# EAGLE design ServoV2 (EAGLE 7.1.0)
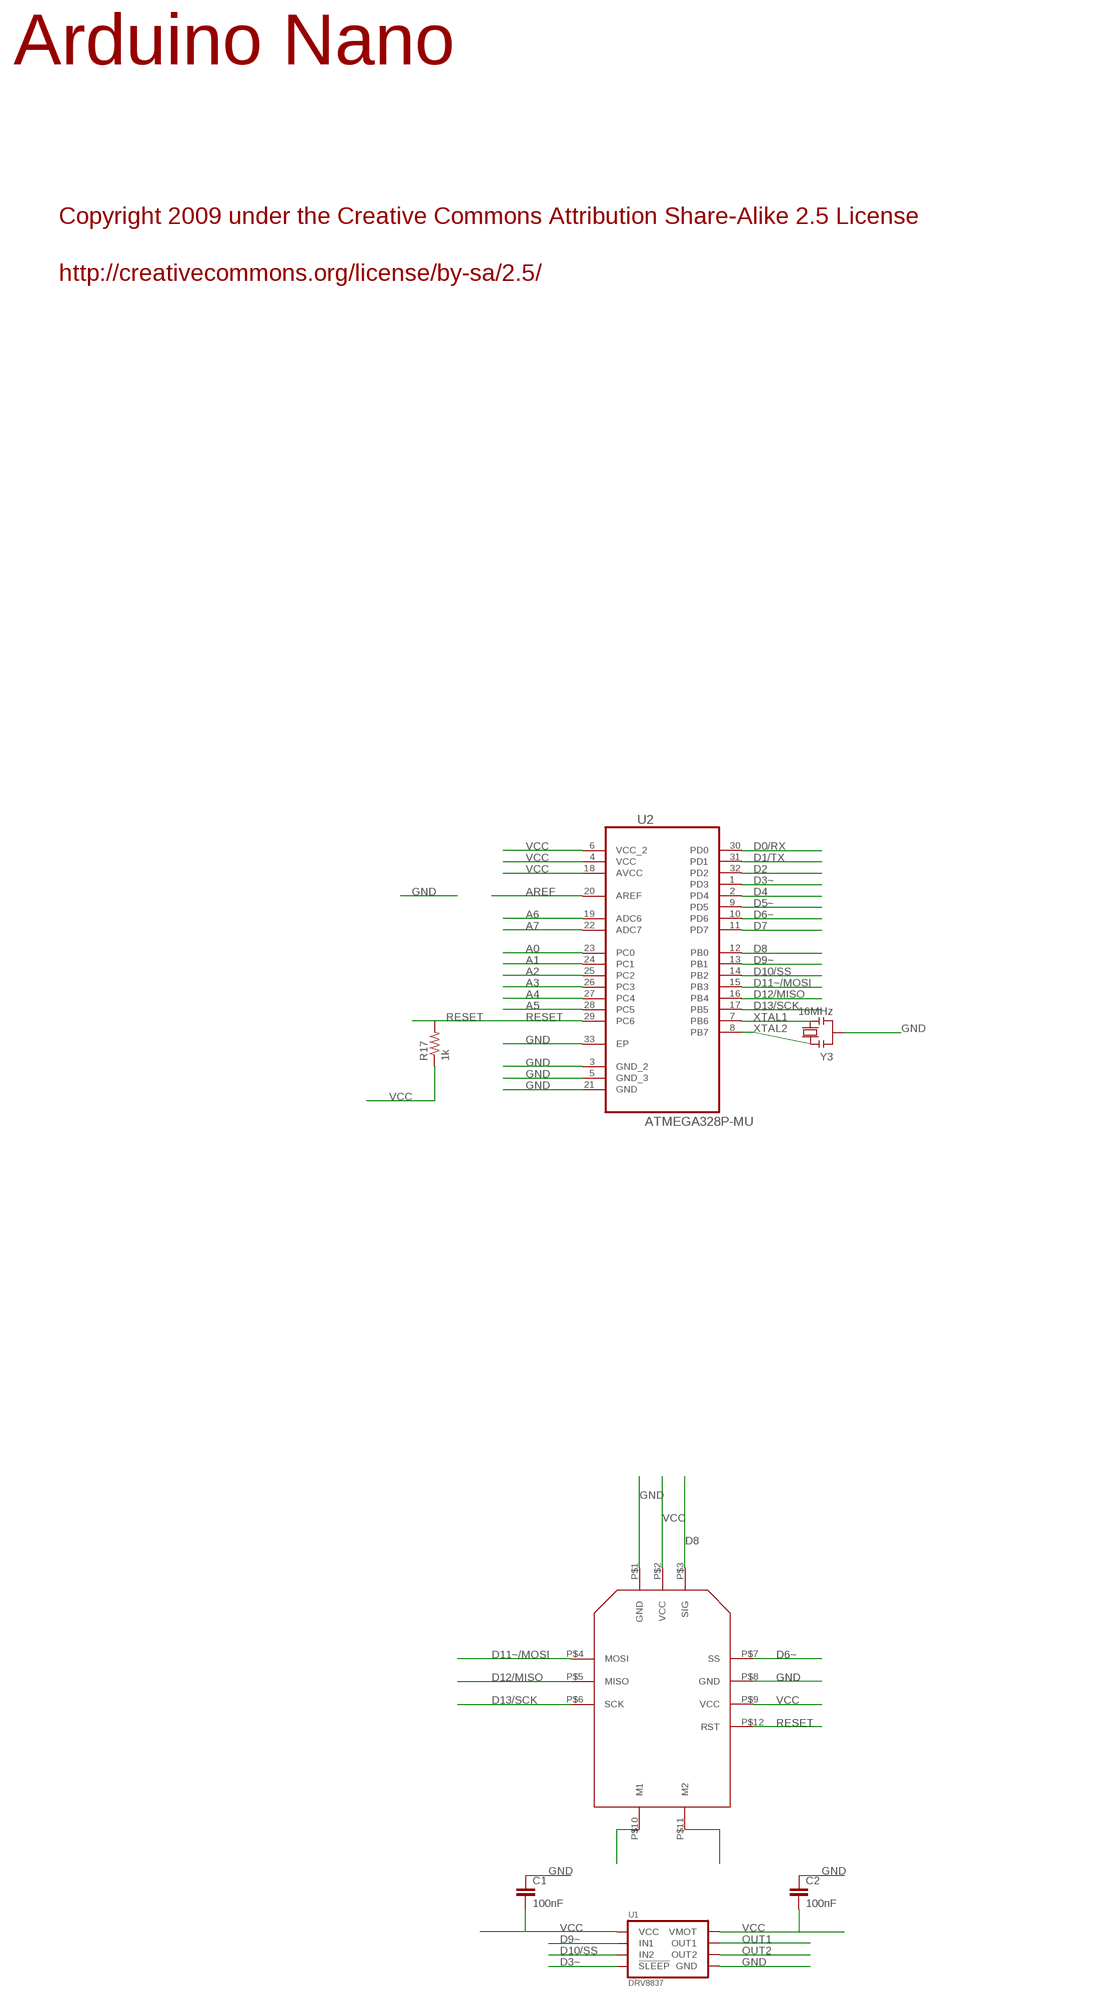
[diagram p0: schematic, sheet 1, part 1 of 2]
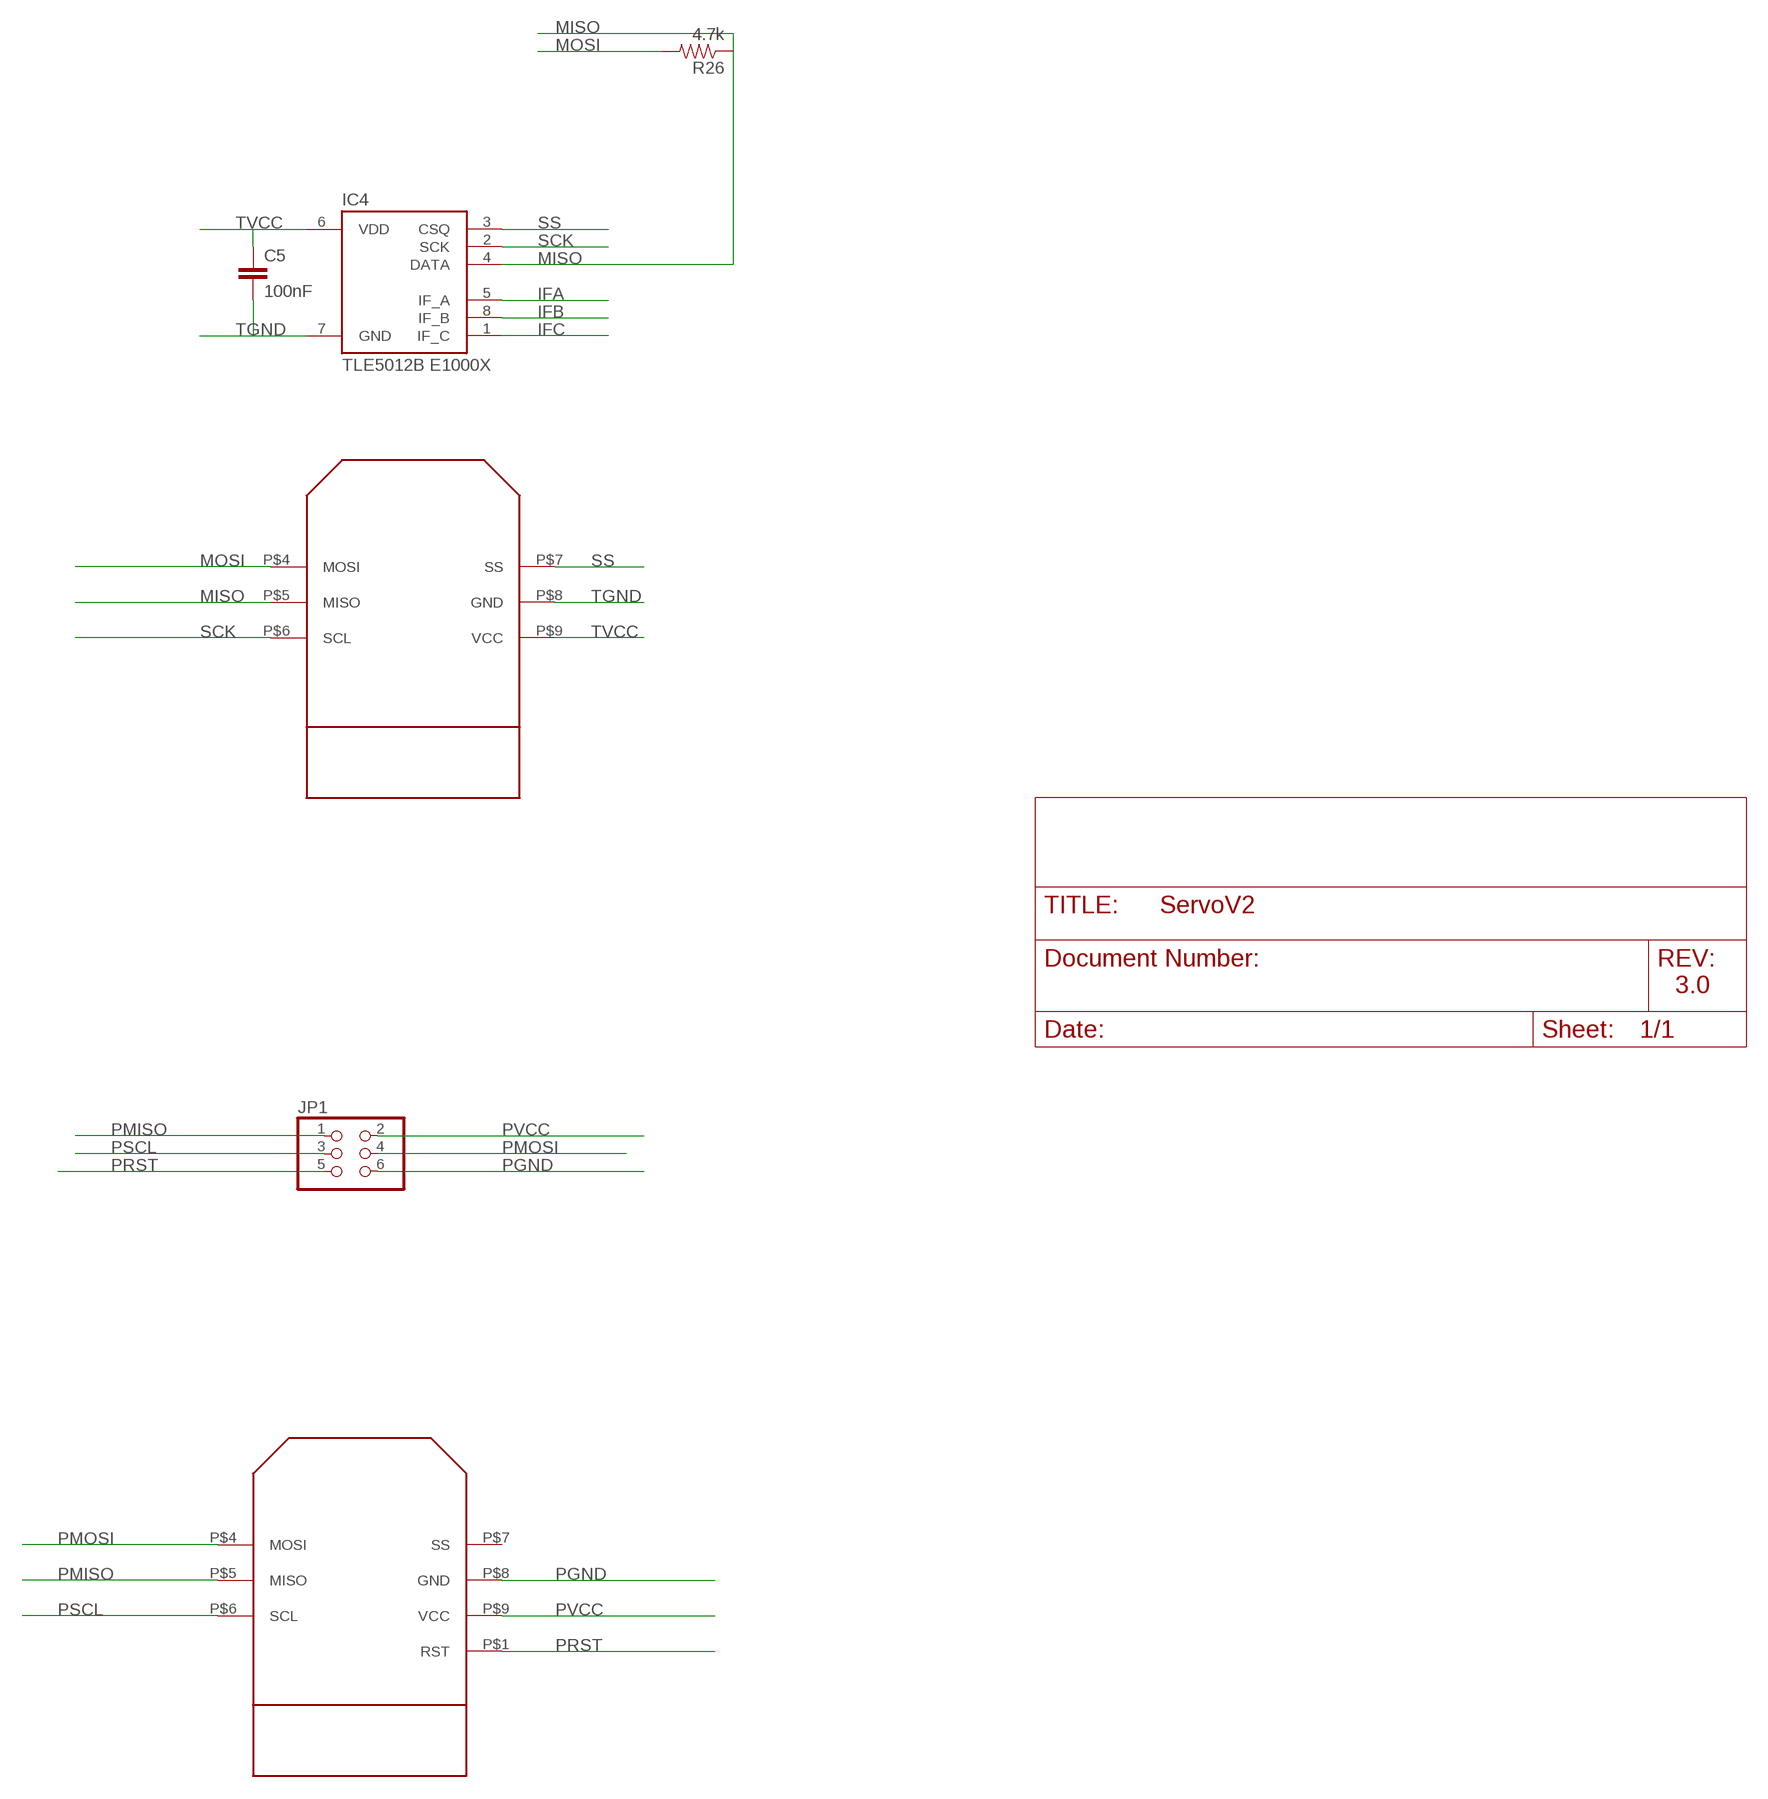
[diagram p1: schematic, sheet 1, part 2 of 2]

## Parts
C1  100nF  0.33UF-50V-10%(0805)  [0805-CAP]
C2  100nF  0.33UF-50V-10%(0805)  [0805-CAP]
C5  100nF  0.33UF-50V-10%(0805)  [0805-CAP]
IC4  TLE5012B E1000X  TLE5012B  [SO08]
JP1  PINHD-2X3  [2X03]
R17  1k  0.05OHM-1/5W-1%(0603)  [0603]
R26  4.7k  0.05OHM-1/5W-1%(0603)  [0603]
U1  DRV8837  [DSG]
U2  ATMEGA328P-MU  [QFN50P500X500X100-33N]
U$1  2TOPSIG  [2TOPSIG]
U$2  2BOTSIG  [2BOTTOMSIG]
U$3  PRGRMR  [PRGRMR]
Y3  16MHz  RESONATORMU  [RESONATOR]

## Nets
A0: U2.23(PC0)
A1: U2.24(PC1)
A2: U2.25(PC2)
A3: U2.26(PC3)
A4: U2.27(PC4)
A5: U2.28(PC5)
A6: U2.19(ADC6)
A7: U2.22(ADC7)
AREF: U2.20(AREF)
D0/RX: U2.30(PD0)
D1/TX: U2.31(PD1)
D2: U2.32(PD2)
D3~: U1.7(!SLEEP) U2.1(PD3)
D4: U2.2(PD4)
D5~: U2.9(PD5)
D6~: U2.10(PD6) U$2.P$7(SS)
D7: U2.11(PD7)
D8: U2.12(PB0) U$2.P$3(SIG)
D9~: U1.6(IN1) U2.13(PB1)
D10/SS: U1.5(IN2) U2.14(PB2)
D11~/MOSI: U2.15(PB3) U$2.P$4(MOSI)
D12/MISO: U2.16(PB4) U$2.P$5(MISO)
D13/SCK: U2.17(PB5) U$2.P$6(SCK)
GND: C1.1 C2.1 U1.4(GND) U1.PAD(GND) U2.3(GND_2) U2.5(GND_3) U2.21(GND) U2.33(EP) U$2.P$1(GND) U$2.P$8(GND) Y3.2
IFA: IC4.5(IF_A)
IFB: IC4.8(IF_B)
IFC: IC4.1(IF_C)
MISO: IC4.4(DATA) R26.1 U$1.P$5(MISO)
MOSI: R26.2 U$1.P$4(MOSI)
OUT1: U1.2(OUT1) U$2.P$11(M2)
OUT2: U1.3(OUT2) U$2.P$10(M1)
PGND: JP1.6 U$3.P$8(GND)
PMISO: JP1.1 U$3.P$5(MISO)
PMOSI: JP1.4 U$3.P$4(MOSI)
PRST: JP1.5 U$3.P$1(RST)
PSCL: JP1.3 U$3.P$6(SCL)
PVCC: JP1.2 U$3.P$9(VCC)
RESET: R17.2 U2.29(PC6) U$2.P$12(RST)
SCK: IC4.2(SCK) U$1.P$6(SCL)
SS: IC4.3(CSQ) U$1.P$7(SS)
TGND: C5.2 IC4.7(GND) U$1.P$8(GND)
TVCC: C5.1 IC4.6(VDD) U$1.P$9(VCC)
VCC: C1.2 C2.2 R17.1 U1.1(VMOT) U1.8(VCC) U2.4(VCC) U2.6(VCC_2) U2.18(AVCC) U$2.P$2(VCC) U$2.P$9(VCC)
XTAL1: U2.7(PB6) Y3.3
XTAL2: U2.8(PB7) Y3.1
Unconnected: U$3.P$7(SS)

## Notes on the sheet
- Arduino Nano
- Copyright 2009 under the Creative Commons Attribution Share-Alike 2.5 License
- http://creativecommons.org/license/by-sa/2.5/
- 3.0

## Library data of the parts
C1 C2 C5 = SparkFun-Capacitors:0.33UF-50V-10%(0805): CAP-08469; PROD_ID: CAP-08469; VALUE: 0.33uF
IC4 = # stdlib:TLE5012B
JP1 = 2x3pinhd:PINHD-2X3: PIN HEADER
R17 R26 = SparkFun-Resistors:0.05OHM-1/5W-1%(0603); PROD_ID: RES-12535
U1 = packages(ti):DRV8837
U2 = Atmel_By_element14_Batch_1-00:ATMEGA328P-MU: Programmable Flash; MPN: ATMEGA328P-MU; OC_FARNELL: 1748522; OC_NEWARK: 26R2526; PACKAGE: QFN-32; SUPPLIER: Atmel
U$1 = Servo:2TOPSIG
U$2 = Servo:2BOTSIG
U$3 = Servo:PRGRMR
Y3 = resonator:RESONATOR

## Board
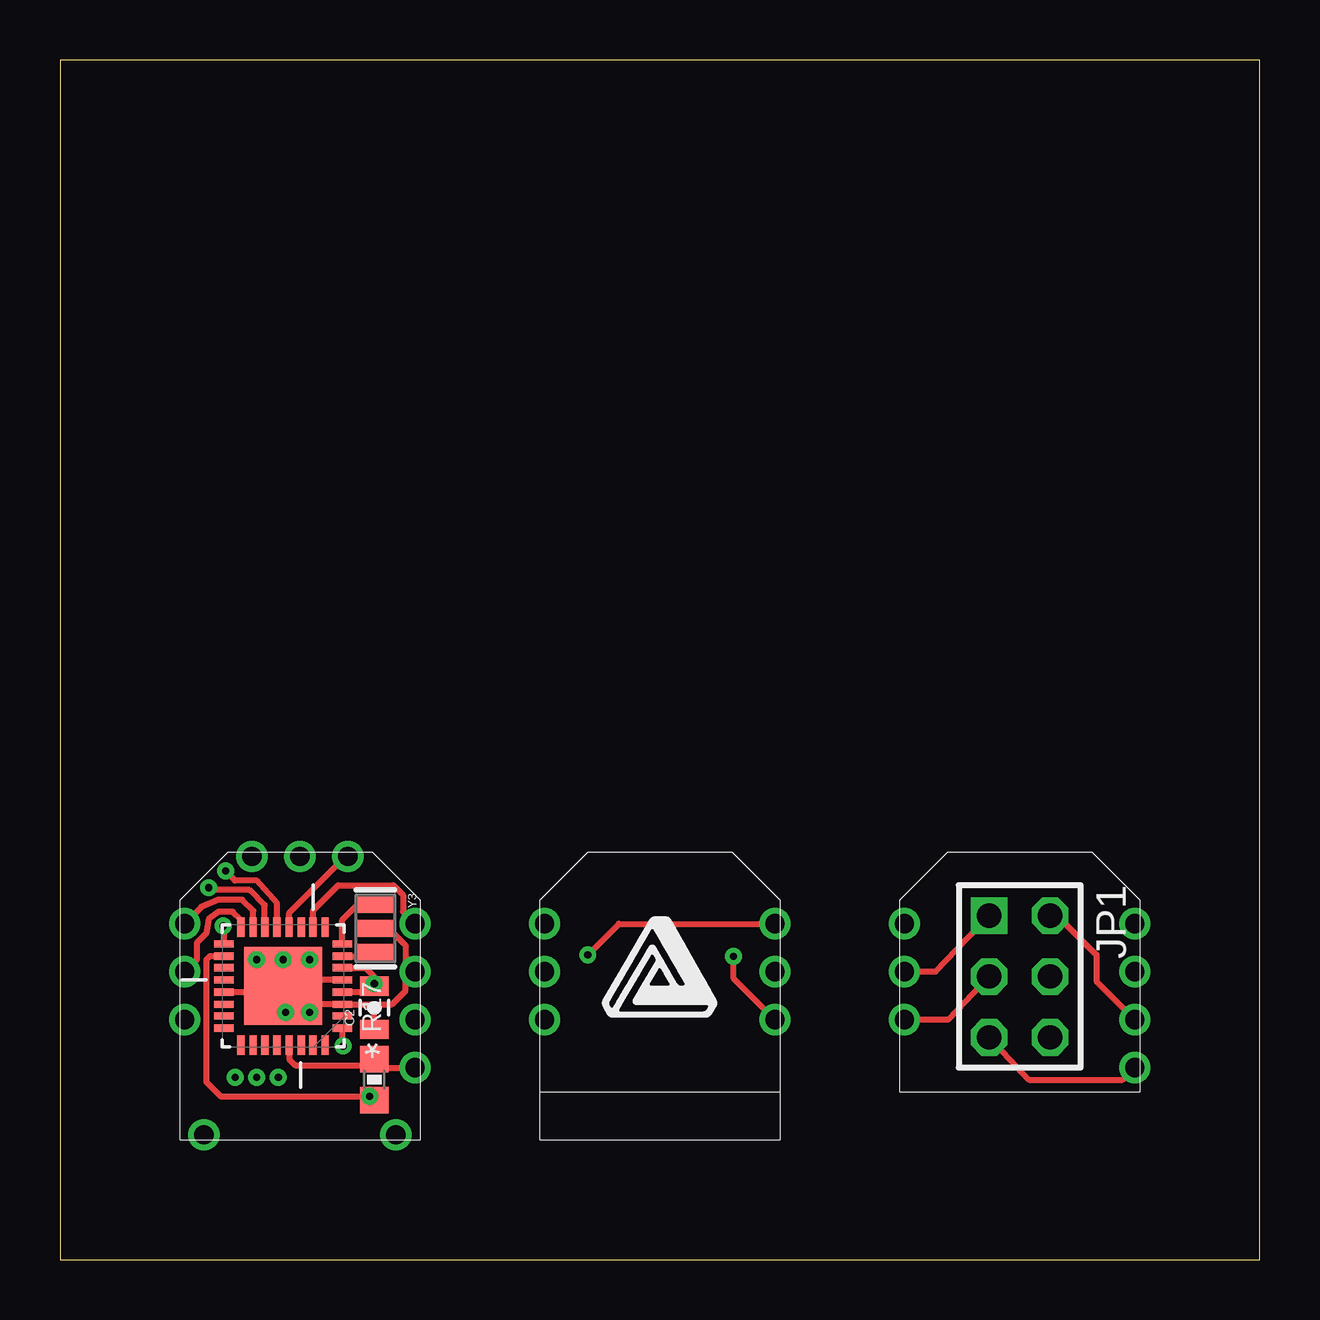
[diagram p2: board, top side]
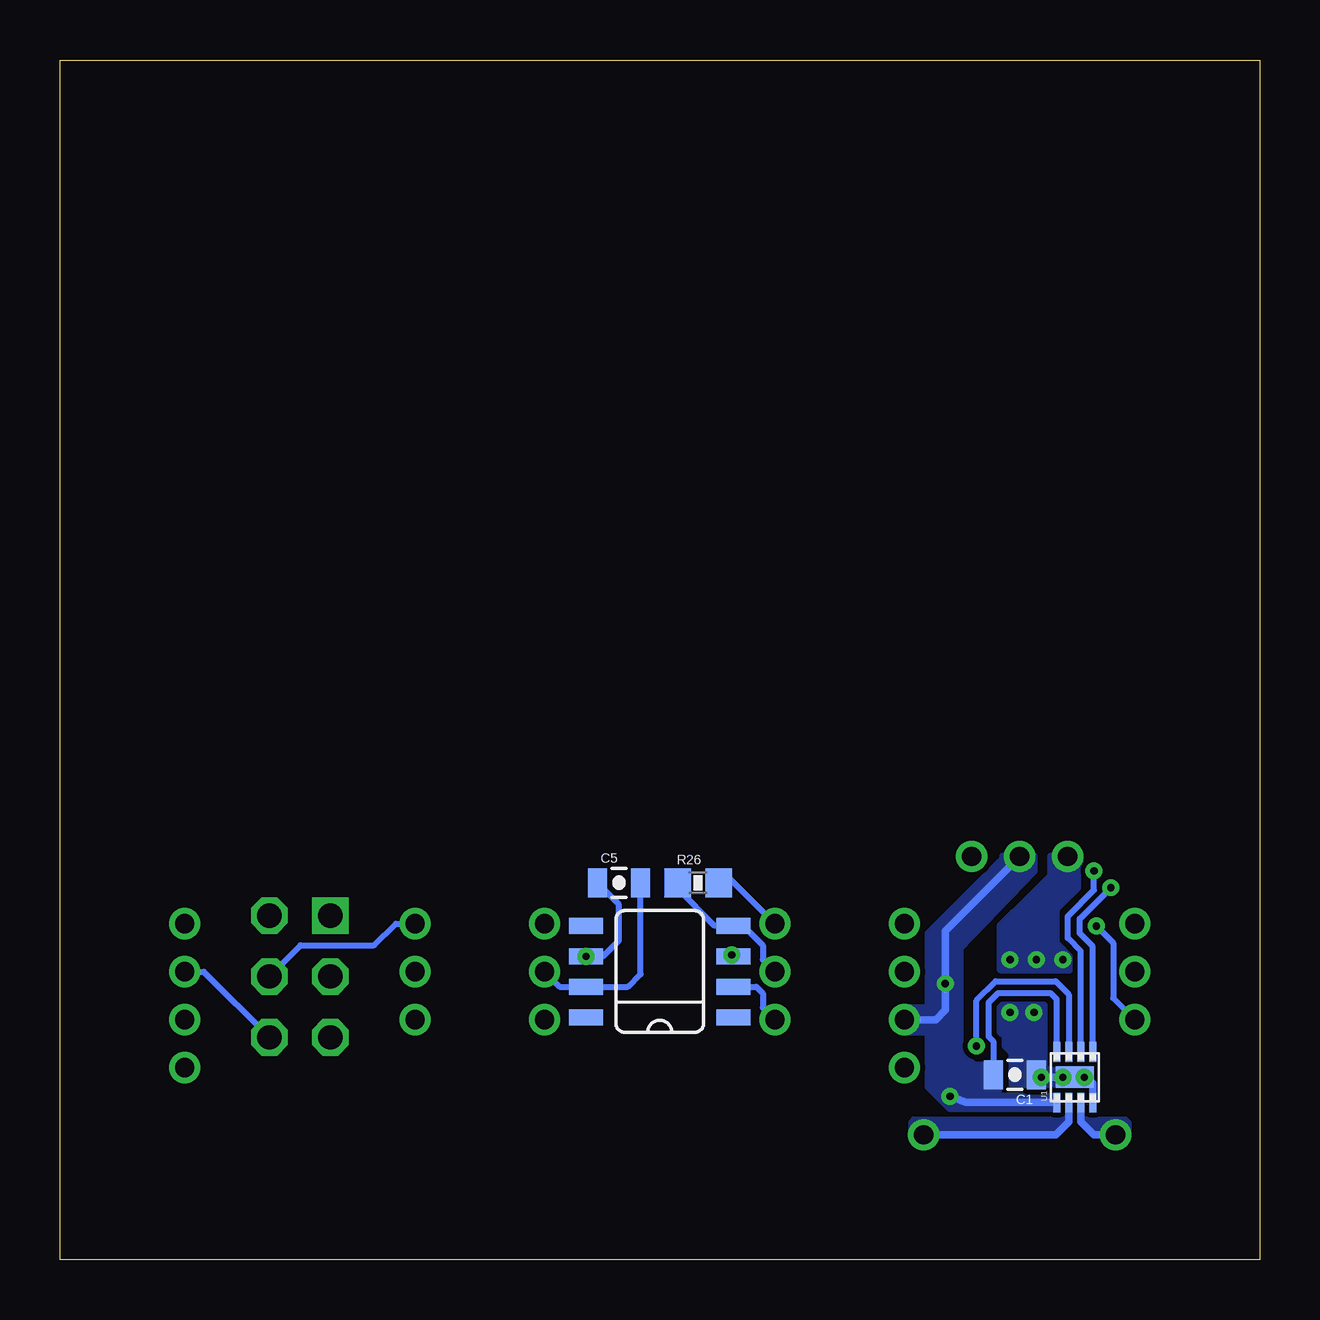
[diagram p3: board, bottom side, seen from below]

Size 50 x 50 mm. Coordinates in mm from the lower left corner, seen from the top.
Outline: 0,0 50,0 50,50 0,50 0,0
Copper layers (1*16): Top 0.035mm / dielectric 1.2mm / Bottom 0.035mm
Design rules "defaultjelle": minimum track width 10mil, minimum drill 13mil, track to track 8mil, track to pad 8mil, pad to pad 8mil, via to via 8mil, smd to smd 8mil, copper to edge 0.3mm, drill to drill 0.25mm, minimum pad ring 10mil, minimum via ring 8mil, stop-mask expansion 4mil, vias tented up to drill 0mil, thermal gap 10mil

### Footprints (pad centres in the part's own frame; a part is rotated, then mirrored left to right if it is on the bottom)
0805-CAP = smd 0.8 x 1.2: 1 -0.9,0; 2 0.9,0
SO08 = smd 0.66 x 1.397: 1 0,-3.073; 2 1.27,-3.073; 3 2.54,-3.073; 4 3.81,-3.073; 5 3.81,3.073; 6 2.54,3.073; 7 1.27,3.073; 8 0,3.073
2X03 = drill 1.016 square: 1 -2.54,-1.27 | drill 1.016 octagon: 2 -2.54,1.27; 3 0,-1.27; 4 0,1.27; 5 2.54,-1.27; 6 2.54,1.27
0603 = smd 1.1 x 1.2: 1 -0.85,0; 2 0.85,0
DSG = smd 0.813 x 0.305: 1 -1.056,0.75; 2 -1.056,0.25; 3 -1.056,-0.25; 4 -1.056,-0.75; 5 1.056,-0.75; 6 1.056,-0.25; 7 1.056,0.25; 8 1.056,0.75 | smd 0.9 x 1.6: PAD 0,0
QFN50P500X500X100-33N = smd 0.813 x 0.305: 1 -2.464,1.753; 2 -2.464,1.245; 3 -2.464,0.762; 4 -2.464,0.254; 5 -2.464,-0.254; 6 -2.464,-0.762; 7 -2.464,-1.245; 8 -2.464,-1.753; 17 2.464,-1.753; 18 2.464,-1.245; 19 2.464,-0.762; 20 2.464,-0.254; 21 2.464,0.254; 22 2.464,0.762; 23 2.464,1.245; 24 2.464,1.753 | smd 0.305 x 0.813: 9 -1.753,-2.464; 10 -1.245,-2.464; 11 -0.762,-2.464; 12 -0.254,-2.464; 13 0.254,-2.464; 14 0.762,-2.464; 15 1.245,-2.464; 16 1.753,-2.464; 25 1.753,2.464; 26 1.245,2.464; 27 0.762,2.464; 28 0.254,2.464; 29 -0.254,2.464; 30 -0.762,2.464; 31 -1.245,2.464; 32 -1.753,2.464 | smd 3.251 x 3.251: 33 0,0
2TOPSIG = drill 0.8: P$4 0.2,9; P$5 0.2,7; P$6 0.2,5; P$7 9.8,9; P$8 9.8,7; P$9 9.8,5
2BOTTOMSIG = drill 0.8: P$1 3,11.8; P$2 5,11.8; P$3 7,11.8; P$4 0.2,9; P$5 0.2,7; P$6 0.2,5; P$7 9.8,9; P$8 9.8,7; P$9 9.8,5; P$10 1,0.2; P$11 9,0.2; P$12 9.8,3
PRGRMR = drill 0.8: P$1 9.8,3; P$4 0.2,9; P$5 0.2,7; P$6 0.2,5; P$7 9.8,9; P$8 9.8,7; P$9 9.8,5
RESONATOR = smd 0.7 x 1.5: 1 -1,0; 2 0,0; 3 1,0

### Placement (x,y rotation side)
C1  10.2,7.7 180 bottom
C2  13.1,10.5 90 top
C5  26.7,15.7 0 bottom
IC4  25,10.1 90 bottom
JP1  40,11.8 270 top
R17  13.1,7.5 90 top
R26  23.4,15.7 0 bottom
U1  7.7,7.6 90 bottom
U2  9.3,11.4 180 top
U$1  20,5 0 top
U$2  5,5 0 top
U$3  35,5 0 top
Y3  13.15,13.8 270 top

### Tracks (layer width: path | path; a pad name or v marks a point on that pad's centre or on a via)
D3~  (via drill 0.3)
  Top 0.254: U2.1 11.76,8.94 v11.8,8.9
  Bottom 0.254: v11.8,8.9 11.8,10.8 11,11.6 8.5,11.6 7.95,11.05 U1.7
D6~
  Top 0.254: U2.10 10.54,14.54 11.6,15.6 13.9,15.6 14.3,15.2 14.3,14.5 U$2.P$7
D8
  Top 0.254: U2.12 9.55,14.45 11.9,16.8 U$2.P$3
D9~  (via drill 0.3)
  Top 0.254: U2.13 9.05,14.85 8.2,15.8 7.3,15.8 v6.9,16.2
  Bottom 0.254: U1.6 7.45,12.85 8,13.4 8,14.3 6.9,15.4 v6.9,16.2
D10/SS  (via drill 0.3)
  Top 0.254: U2.14 8.54,14.76 7.9,15.4 6.3,15.4 v6.2,15.5
  Bottom 0.254: U1.5 6.95,13.05 7.5,13.6 7.5,14.2 v6.2,15.5
D11~/MOSI
  Top 0.254: U$2.P$4 5.9,14.7 6.6,15 7.6,15 8.05,14.54 U2.15
D12/MISO
  Top 0.254: U2.16 7.55,14.15 7.2,14.5 6.6,14.5 6.2,14.2 6.1,13.6 5.7,13.2 5.7,12.5 U$2.P$5
D13/SCK  (via drill 0.3)
  Top 0.254: U2.17 6.84,13.86 v6.8,13.9
  Bottom 0.254: v6.8,13.9 6.1,13.2 6.1,10.9 U$2.P$6
GND  (via drill 0.3)
  Top 0.254: 9.5,10 U2.33 | Y3.2 13.7,13.8 14.4,13.1 14.4,12.4 U$2.P$8 14.4,11.6 14.4,11.2 13.84,10.64 13.1,10.64 | 13.1,10.64 U2.3 10.06,10.64 U2.33 | C2.1 13.1,10.64 | U2.5 9.55,11.65 U2.33 | U2.21 8.8,11.15 | 8.8,11.15 9.05,11.15 U2.33 | v9.4,10.3 8.8,10.9 8.8,11.15
  Top 0.305: v9.3,12.5 U2.33
  Bottom 0.305: U1.4 6.95,7.35 7.2,7.6 v7.3,7.6 U1.PAD v8.2,7.6 v9.1,7.6 9.2,7.6 C1.1
  other vias: 8.2,12.5 10.4,12.5 10.4,10.3
  pour Bottom (no thermals): 7.5,16.8 7.5,16.6 7.6,16.5 7.6,15.5 8.3,14.8 8.5,14.6 8.5,13.5 8.5,13.2 7.9,12.6 7.9,12.1 10.8,12.1 10.8,13.9 9.6,15.1 8.7,16 8.7,16.8
  pour Bottom (no thermals): 7.1,7.3 10.3,7.3 10.3,8.6 10.5,8.8 10.6,8.9 10.6,9.3 10.8,9.5 10.8,10.5 10.7,10.6 9,10.6 9,8 8.9,7.9 7.1,7.9
MISO
  Bottom 0.254: U$1.P$5 20.7,12.5 20.7,13.1 21.51,13.91 IC4.4 22.71,13.91 24.25,15.45 R26.1
MOSI
  Bottom 0.254: U$1.P$4 22.2,16 R26.2
OUT1
  Bottom 0.305: U1.2 7.95,5.75 8.5,5.2 U$2.P$11
  pour Bottom (no thermals): 14.5,5.2 8.5,5.2 8,5.7 8,5.9 8.1,5.8 14.4,5.8 14.5,5.7
OUT2
  Bottom 0.305: U1.3 7.45,5.75 6.9,5.2 U$2.P$10
  pour Bottom (no thermals): 6,5.2 6.9,5.2 7.4,5.7 7.4,5.8 5.6,5.8 5.5,5.7 5.5,5.2
PGND
  Bottom 0.254: U$3.P$8 44.01,12 JP1.6
PMISO
  Top 0.254: JP1.1 36.49,12 U$3.P$5
PMOSI
  Bottom 0.254: JP1.4 39.97,13.1 36.9,13.1 36,14 U$3.P$4
PRST
  Top 0.254: JP1.5 40.39,7.5 44.3,7.5 U$3.P$1
PSCL
  Top 0.254: JP1.3 37.03,10 U$3.P$6
PVCC
  Top 0.254: JP1.2 41.56,14.34 43.2,12.7 43.2,11.6 U$3.P$9
RESET
  Top 0.254: U2.29 9.55,8.35 9.8,8.1 12.85,8.1 R17.2 13.45,8 U$2.P$12
SCK
  Bottom 0.254: IC4.2 20.97,11.37 20.7,11.1 20.7,10.5 U$1.P$6
SS  (via drill 0.3)
  Top 0.254: v22,12.7 23.3,14 U$1.P$7
  Bottom 0.254: IC4.3 v22,12.7
TGND
  Bottom 0.254: U$1.P$8 29.17,11.37 IC4.7 26.33,11.37 25.8,11.9 C5.2
TVCC  (via drill 0.3)
  Top 0.254: U$1.P$9 28.07,11.73 IC4.6
  Bottom 0.254: IC4.6 27.36,12.64 26.7,13.3 26.7,14.8 C5.1
  other vias: 28.07,12.64
VCC  (via drill 0.3)
  Top 0.254: U2.18 6.25,12.64 6.1,12.5 6.1,7.4 6.7,6.8 v12.9,6.8 | U2.4 12.85,11.15 C2.2 v13.1,11.5 13.1,11.8 12.74,12.16 U2.6
  Top 0.305: v12.9,6.8 12.75,7 R17.1
  Bottom 0.254: U1.8 8.45,10.85 8.7,11.1 10.9,11.1 11.3,10.7 11.3,9.3 11.1,9.1 C1.2
  Bottom 0.305: U1.1 12.24,6.54 v12.9,6.8 | U$2.P$9 13.5,10 13.1,10.4 v13.1,11.5 13.1,13.7 U$2.P$2
  pour Bottom (no thermals): 9.4,16.8 9.4,16.2 12.5,13 12.5,8.7 11.9,8.1 10.9,8.1 10.9,6.9 10.8,6.8 8.5,6.8 8.5,6.3 12.9,6.3 13.8,7.2 13.8,9.5 14.8,9.5 14.8,10.5 13.8,10.5 13.8,13.6 10.7,16.7 10.7,16.8
XTAL1
  Top 0.254: U2.7 12.99,12.64 Y3.3
XTAL2
  Top 0.254: U2.8 11.76,14.16 12.4,14.8 Y3.1

### Text on the board
200bmp: E:/Documents/Hobby/Project Programmable Servo/TOP2.bmp
201bmp: E:/Documents/Hobby/Project Programmable Servo/MIDDLE.bmp
202bmp: E:/Documents/Hobby/Project Programmable Servo/MIDDLE2.bmp
203bmp: E:/Documents/Hobby/Project Programmable Servo/BOTTOM.bmp
204bmp: E:/Documents/Hobby/Project Programmable Servo/BOTTOM2.bmp